# Altium schematic sheet 2k ohm 75V SCH.schdoc
size 127 x 99 mm
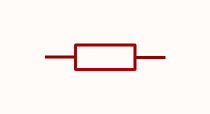
[diagram p0: 2k ohm 75V SCH.schdoc]

## Parts
R?  2kΩ  [R0603]  (value not drawn)

## Nets

Not connected (* = marked no-connect by the designer): R? 1 2

## Library data of the parts
R? = RC0603FR-072KL: Manufacturer: YAGEO(国巨); Add into BOM: yes; Tolerance: ±1%; Power(Watts): 100mW; Voltage-Supply(Max): 75V; Temperature Coefficient: ±100ppm/℃; Symbol: RC0603FR-072KL; Device: RC0603FR-072KL; LCSC Part Name: 厚膜电阻 2kΩ ±1% 100mW; Supplier Part: C105576; Manufacturer Part: RC0603FR-072KL; Supplier Footprint: 0603; JLCPCB Part Class: Extended Part; Datasheet: https://atta.szlcsc.com/upload/public/pdf/source/20180316/70C0E2BDAE7FCC62C531A5A58D202EE1.pdf; Supplier: LCSC; Convert to PCB: yes; Type: Thick Film Resistors; Value: 2kΩ; Operating Temperature: -55℃~+155℃